# Altium schematic sheet ESC.SchDoc: FlightControlBoard-ESC
size A3; SheetNumber: 2; SheetTotal: 5
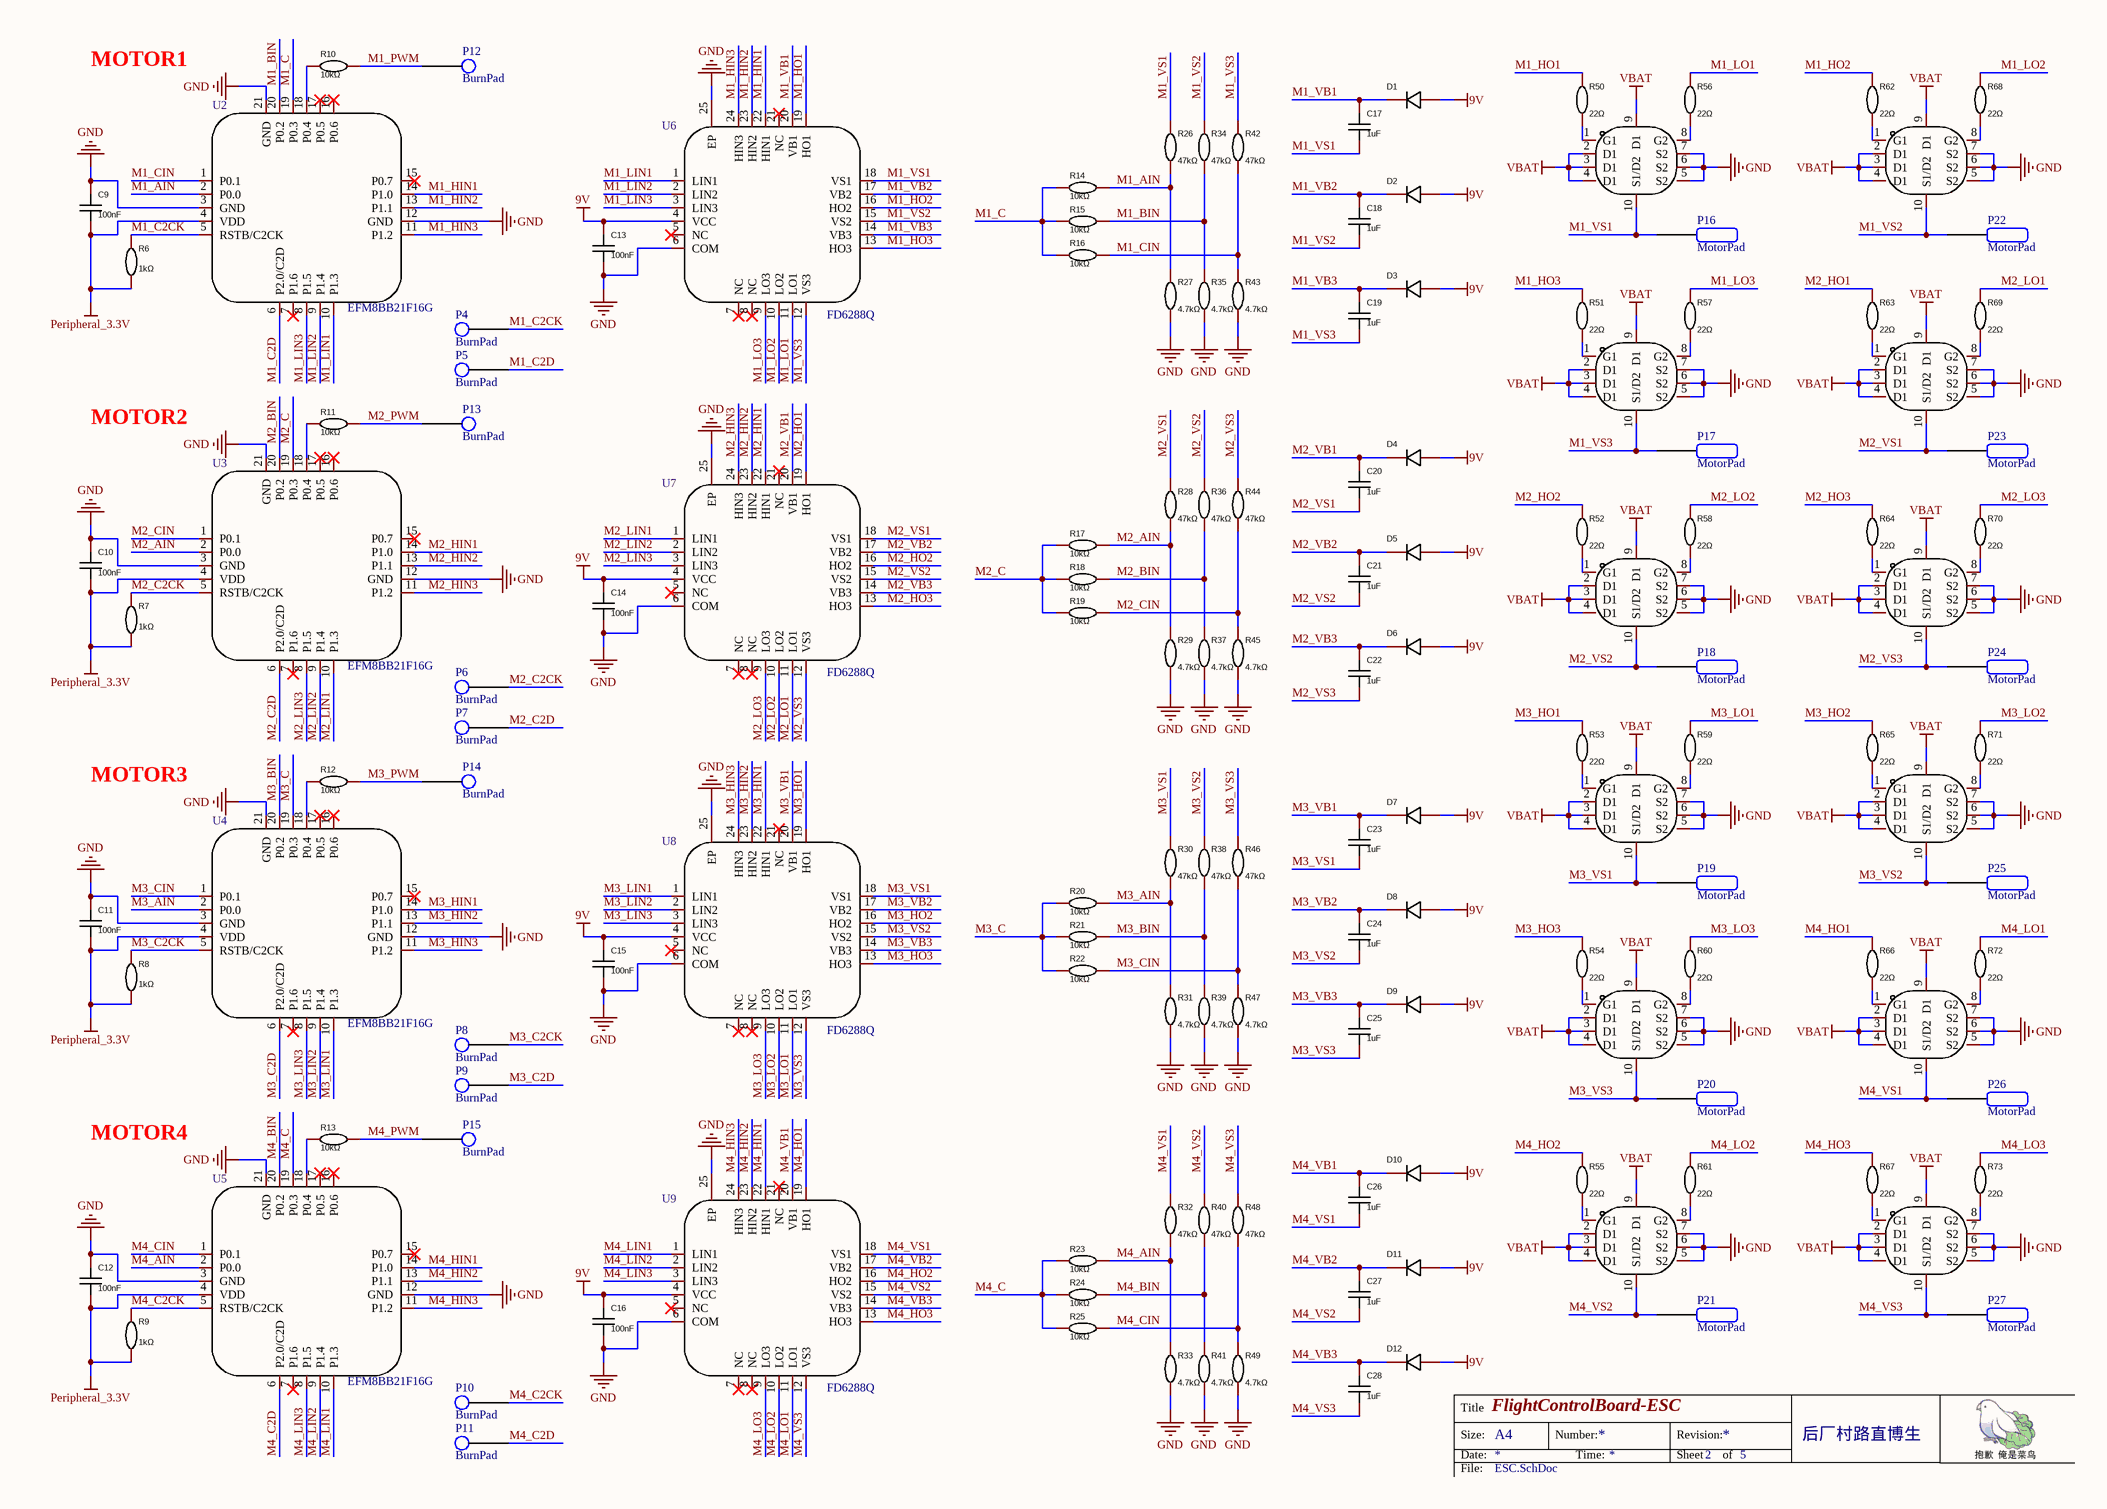
[diagram p0: ESC.SchDoc]

## Parts
C9  100nF  [C0201]
C10  100nF  [C0201]
C11  100nF  [C0201]
C12  100nF  [C0201]
C13  100nF  [C0201]
C14  100nF  [C0201]
C15  100nF  [C0201]
C16  100nF  [C0201]
C17  1uF  [C0402]
C18  1uF  [C0402]
C19  1uF  [C0402]
C20  1uF  [C0402]
C21  1uF  [C0402]
C22  1uF  [C0402]
C23  1uF  [C0402]
C24  1uF  [C0402]
C25  1uF  [C0402]
C26  1uF  [C0402]
C27  1uF  [C0402]
C28  1uF  [C0402]
D1  1N4148WT T4  [SOD-523]  (value not drawn)
D2  1N4148WT T4  [SOD-523]  (value not drawn)
D3  1N4148WT T4  [SOD-523]  (value not drawn)
D4  1N4148WT T4  [SOD-523]  (value not drawn)
D5  1N4148WT T4  [SOD-523]  (value not drawn)
D6  1N4148WT T4  [SOD-523]  (value not drawn)
D7  1N4148WT T4  [SOD-523]  (value not drawn)
D8  1N4148WT T4  [SOD-523]  (value not drawn)
D9  1N4148WT T4  [SOD-523]  (value not drawn)
D10  1N4148WT T4  [SOD-523]  (value not drawn)
D11  1N4148WT T4  [SOD-523]  (value not drawn)
D12  1N4148WT T4  [SOD-523]  (value not drawn)
P4  BurnPad  [BurnPad_0.5mm]
P5  BurnPad  [BurnPad_0.5mm]
P6  BurnPad  [BurnPad_0.5mm]
P7  BurnPad  [BurnPad_0.5mm]
P8  BurnPad  [BurnPad_0.5mm]
P9  BurnPad  [BurnPad_0.5mm]
P10  BurnPad  [BurnPad_0.5mm]
P11  BurnPad  [BurnPad_0.5mm]
P12  BurnPad  [BurnPad_0.8mm]
P13  BurnPad  [BurnPad_0.8mm]
P14  BurnPad  [BurnPad_0.8mm]
P15  BurnPad  [BurnPad_0.8mm]
P16  MotorPad  [MOTOR HALF HOLE]
P17  MotorPad  [MOTOR HALF HOLE]
P18  MotorPad  [MOTOR HALF HOLE]
P19  MotorPad  [MOTOR HALF HOLE]
P20  MotorPad  [MOTOR HALF HOLE]
P21  MotorPad  [MOTOR HALF HOLE]
P22  MotorPad  [MOTOR HALF HOLE]
P23  MotorPad  [MOTOR HALF HOLE]
P24  MotorPad  [MOTOR HALF HOLE]
P25  MotorPad  [MOTOR HALF HOLE]
P26  MotorPad  [MOTOR HALF HOLE]
P27  MotorPad  [MOTOR HALF HOLE]
Q1  AON7934  [DFN-8]  (value not drawn)
Q2  AON7934  [DFN-8]  (value not drawn)
Q3  AON7934  [DFN-8]  (value not drawn)
Q4  AON7934  [DFN-8]  (value not drawn)
Q5  AON7934  [DFN-8]  (value not drawn)
Q6  AON7934  [DFN-8]  (value not drawn)
Q7  AON7934  [DFN-8]  (value not drawn)
Q8  AON7934  [DFN-8]  (value not drawn)
Q9  AON7934  [DFN-8]  (value not drawn)
Q10  AON7934  [DFN-8]  (value not drawn)
Q11  AON7934  [DFN-8]  (value not drawn)
Q12  AON7934  [DFN-8]  (value not drawn)
R6  1kΩ  [R0201]
R7  1kΩ  [R0201]
R8  1kΩ  [R0201]
R9  1kΩ  [R0201]
R10  10kΩ  [R0201]
R11  10kΩ  [R0201]
R12  10kΩ  [R0201]
R13  10kΩ  [R0201]
R14  10kΩ  [R0201]
R15  10kΩ  [R0201]
R16  10kΩ  [R0201]
R17  10kΩ  [R0201]
R18  10kΩ  [R0201]
R19  10kΩ  [R0201]
R20  10kΩ  [R0201]
R21  10kΩ  [R0201]
R22  10kΩ  [R0201]
R23  10kΩ  [R0201]
R24  10kΩ  [R0201]
R25  10kΩ  [R0201]
R26  47kΩ  [R0201]
R27  4.7kΩ  [R0201]
R28  47kΩ  [R0201]
R29  4.7kΩ  [R0201]
R30  47kΩ  [R0201]
R31  4.7kΩ  [R0201]
R32  47kΩ  [R0201]
R33  4.7kΩ  [R0201]
R34  47kΩ  [R0201]
R35  4.7kΩ  [R0201]
R36  47kΩ  [R0201]
R37  4.7kΩ  [R0201]
R38  47kΩ  [R0201]
R39  4.7kΩ  [R0201]
R40  47kΩ  [R0201]
R41  4.7kΩ  [R0201]
R42  47kΩ  [R0201]
R43  4.7kΩ  [R0201]
R44  47kΩ  [R0201]
R45  4.7kΩ  [R0201]
R46  47kΩ  [R0201]
R47  4.7kΩ  [R0201]
R48  47kΩ  [R0201]
R49  4.7kΩ  [R0201]
R50  22Ω  [R0201]
R51  22Ω  [R0201]
R52  22Ω  [R0201]
R53  22Ω  [R0201]
R54  22Ω  [R0201]
R55  22Ω  [R0201]
R56  22Ω  [R0201]
R57  22Ω  [R0201]
R58  22Ω  [R0201]
R59  22Ω  [R0201]
R60  22Ω  [R0201]
R61  22Ω  [R0201]
R62  22Ω  [R0201]
R63  22Ω  [R0201]
R64  22Ω  [R0201]
R65  22Ω  [R0201]
R66  22Ω  [R0201]
R67  22Ω  [R0201]
R68  22Ω  [R0201]
R69  22Ω  [R0201]
R70  22Ω  [R0201]
R71  22Ω  [R0201]
R72  22Ω  [R0201]
R73  22Ω  [R0201]
U2  EFM8BB21F16G  [QFN-20_L3.0-W3.0-P0.50-BL-EP1.7_EFM8BB21F16G]
U3  EFM8BB21F16G  [QFN-20_L3.0-W3.0-P0.50-BL-EP1.7_EFM8BB21F16G]
U4  EFM8BB21F16G  [QFN-20_L3.0-W3.0-P0.50-BL-EP1.7_EFM8BB21F16G]
U5  EFM8BB21F16G  [QFN-20_L3.0-W3.0-P0.50-BL-EP1.7_EFM8BB21F16G]
U6  FD6288Q  [QFN-24_L4.0-W4.0-P0.50-BL-EP2.6]
U7  FD6288Q  [QFN-24_L4.0-W4.0-P0.50-BL-EP2.6]
U8  FD6288Q  [QFN-24_L4.0-W4.0-P0.50-BL-EP2.6]
U9  FD6288Q  [QFN-24_L4.0-W4.0-P0.50-BL-EP2.6]

## Nets
9V: C13.2 C14.2 C15.2 C16.2 D1.2(A) D2.2(A) D3.2(A) D4.2(A) D5.2(A) D6.2(A) D7.2(A) D8.2(A) D9.2(A) D10.2(A) D11.2(A) D12.2(A) U6.4(VCC) U7.4(VCC) U8.4(VCC) U9.4(VCC)
GND: C9.2 C10.2 C11.2 C12.2 C13.1 C14.1 C15.1 C16.1 Q1.5(S2) Q1.6(S2) Q1.7(S2) Q2.5(S2) Q2.6(S2) Q2.7(S2) Q3.5(S2) Q3.6(S2) Q3.7(S2) Q4.5(S2) Q4.6(S2) Q4.7(S2) Q5.5(S2) Q5.6(S2) Q5.7(S2) Q6.5(S2) Q6.6(S2) Q6.7(S2) Q7.5(S2) Q7.6(S2) Q7.7(S2) Q8.5(S2) Q8.6(S2) Q8.7(S2) Q9.5(S2) Q9.6(S2) Q9.7(S2) Q10.5(S2) Q10.6(S2) Q10.7(S2) Q11.5(S2) Q11.6(S2) Q11.7(S2) Q12.5(S2) Q12.6(S2) Q12.7(S2) R27.1 R29.1 R31.1 R33.1 R35.1 R37.1 R39.1 R41.1 R43.1 R45.1 R47.1 R49.1 U2.3(GND) U2.12(GND) U2.21(GND) U3.3(GND) U3.12(GND) U3.21(GND) U4.3(GND) U4.12(GND) U4.21(GND) U5.3(GND) U5.12(GND) U5.21(GND) U6.6(COM) U6.25(EP) U7.6(COM) U7.25(EP) U8.6(COM) U8.25(EP) U9.6(COM) U9.25(EP)
Peripheral_3.3V: C9.1 C10.1 C11.1 C12.1 R6.1 R7.1 R8.1 R9.1 U2.4(VDD) U3.4(VDD) U4.4(VDD) U5.4(VDD)
VBAT: Q1.2(D1) Q1.3(D1) Q1.4(D1) Q1.9(D1) Q2.2(D1) Q2.3(D1) Q2.4(D1) Q2.9(D1) Q3.2(D1) Q3.3(D1) Q3.4(D1) Q3.9(D1) Q4.2(D1) Q4.3(D1) Q4.4(D1) Q4.9(D1) Q5.2(D1) Q5.3(D1) Q5.4(D1) Q5.9(D1) Q6.2(D1) Q6.3(D1) Q6.4(D1) Q6.9(D1) Q7.2(D1) Q7.3(D1) Q7.4(D1) Q7.9(D1) Q8.2(D1) Q8.3(D1) Q8.4(D1) Q8.9(D1) Q9.2(D1) Q9.3(D1) Q9.4(D1) Q9.9(D1) Q10.2(D1) Q10.3(D1) Q10.4(D1) Q10.9(D1) Q11.2(D1) Q11.3(D1) Q11.4(D1) Q11.9(D1) Q12.2(D1) Q12.3(D1) Q12.4(D1) Q12.9(D1)
M1_AIN: R14.2 R26.1 R27.2 U2.2(P0.0)
M1_BIN: R15.2 R34.1 R35.2 U2.20(P0.2)
M1_C: R14.1 R15.1 R16.1 U2.19(P0.3)
M1_C2CK: P4.1 R6.2 U2.5(RSTB/C2CK)
M1_C2D: P5.1 U2.6(P2.0/C2D)
M1_CIN: R16.2 R42.1 R43.2 U2.1(P0.1)
M1_HIN1: U2.14(P1.0) U6.22(HIN1)
M1_HIN2: U2.13(P1.1) U6.23(HIN2)
M1_HIN3: U2.11(P1.2) U6.24(HIN3)
M1_HO1: R50.2 U6.19(HO1)
M1_HO2: R62.2 U6.16(HO2)
M1_HO3: R51.2 U6.13(HO3)
M1_LIN1: U2.10(P1.3) U6.1(LIN1)
M1_LIN2: U2.9(P1.4) U6.2(LIN2)
M1_LIN3: U2.8(P1.5) U6.3(LIN3)
M1_LO1: R56.2 U6.11(LO1)
M1_LO2: R68.2 U6.10(LO2)
M1_LO3: R57.2 U6.9(LO3)
M1_PWM: P12.1 R10.2
M1_VB1: C17.2 D1.1(K) U6.20(VB1)
M1_VB2: C18.2 D2.1(K) U6.17(VB2)
M1_VB3: C19.2 D3.1(K) U6.14(VB3)
M1_VS1: C17.1 P16.1 Q1.10(S1/D2) R26.2 U6.18(VS1)
M1_VS2: C18.1 P22.1 Q7.10(S1/D2) R34.2 U6.15(VS2)
M1_VS3: C19.1 P17.1 Q2.10(S1/D2) R42.2 U6.12(VS3)
M2_AIN: R17.2 R28.1 R29.2 U3.2(P0.0)
M2_BIN: R18.2 R36.1 R37.2 U3.20(P0.2)
M2_C: R17.1 R18.1 R19.1 U3.19(P0.3)
M2_C2CK: P6.1 R7.2 U3.5(RSTB/C2CK)
M2_C2D: P7.1 U3.6(P2.0/C2D)
M2_CIN: R19.2 R44.1 R45.2 U3.1(P0.1)
M2_HIN1: U3.14(P1.0) U7.22(HIN1)
M2_HIN2: U3.13(P1.1) U7.23(HIN2)
M2_HIN3: U3.11(P1.2) U7.24(HIN3)
M2_HO1: R63.2 U7.19(HO1)
M2_HO2: R52.2 U7.16(HO2)
M2_HO3: R64.2 U7.13(HO3)
M2_LIN1: U3.10(P1.3) U7.1(LIN1)
M2_LIN2: U3.9(P1.4) U7.2(LIN2)
M2_LIN3: U3.8(P1.5) U7.3(LIN3)
M2_LO1: R69.2 U7.11(LO1)
M2_LO2: R58.2 U7.10(LO2)
M2_LO3: R70.2 U7.9(LO3)
M2_PWM: P13.1 R11.2
M2_VB1: C20.2 D4.1(K) U7.20(VB1)
M2_VB2: C21.2 D5.1(K) U7.17(VB2)
M2_VB3: C22.2 D6.1(K) U7.14(VB3)
M2_VS1: C20.1 P23.1 Q8.10(S1/D2) R28.2 U7.18(VS1)
M2_VS2: C21.1 P18.1 Q3.10(S1/D2) R36.2 U7.15(VS2)
M2_VS3: C22.1 P24.1 Q9.10(S1/D2) R44.2 U7.12(VS3)
M3_AIN: R20.2 R30.1 R31.2 U4.2(P0.0)
M3_BIN: R21.2 R38.1 R39.2 U4.20(P0.2)
M3_C: R20.1 R21.1 R22.1 U4.19(P0.3)
M3_C2CK: P8.1 R8.2 U4.5(RSTB/C2CK)
M3_C2D: P9.1 U4.6(P2.0/C2D)
M3_CIN: R22.2 R46.1 R47.2 U4.1(P0.1)
M3_HIN1: U4.14(P1.0) U8.22(HIN1)
M3_HIN2: U4.13(P1.1) U8.23(HIN2)
M3_HIN3: U4.11(P1.2) U8.24(HIN3)
M3_HO1: R53.2 U8.19(HO1)
M3_HO2: R65.2 U8.16(HO2)
M3_HO3: R54.2 U8.13(HO3)
M3_LIN1: U4.10(P1.3) U8.1(LIN1)
M3_LIN2: U4.9(P1.4) U8.2(LIN2)
M3_LIN3: U4.8(P1.5) U8.3(LIN3)
M3_LO1: R59.2 U8.11(LO1)
M3_LO2: R71.2 U8.10(LO2)
M3_LO3: R60.2 U8.9(LO3)
M3_PWM: P14.1 R12.2
M3_VB1: C23.2 D7.1(K) U8.20(VB1)
M3_VB2: C24.2 D8.1(K) U8.17(VB2)
M3_VB3: C25.2 D9.1(K) U8.14(VB3)
M3_VS1: C23.1 P19.1 Q4.10(S1/D2) R30.2 U8.18(VS1)
M3_VS2: C24.1 P25.1 Q10.10(S1/D2) R38.2 U8.15(VS2)
M3_VS3: C25.1 P20.1 Q5.10(S1/D2) R46.2 U8.12(VS3)
M4_AIN: R23.2 R32.1 R33.2 U5.2(P0.0)
M4_BIN: R24.2 R40.1 R41.2 U5.20(P0.2)
M4_C: R23.1 R24.1 R25.1 U5.19(P0.3)
M4_C2CK: P10.1 R9.2 U5.5(RSTB/C2CK)
M4_C2D: P11.1 U5.6(P2.0/C2D)
M4_CIN: R25.2 R48.1 R49.2 U5.1(P0.1)
M4_HIN1: U5.14(P1.0) U9.22(HIN1)
M4_HIN2: U5.13(P1.1) U9.23(HIN2)
M4_HIN3: U5.11(P1.2) U9.24(HIN3)
M4_HO1: R66.2 U9.19(HO1)
M4_HO2: R55.2 U9.16(HO2)
M4_HO3: R67.2 U9.13(HO3)
M4_LIN1: U5.10(P1.3) U9.1(LIN1)
M4_LIN2: U5.9(P1.4) U9.2(LIN2)
M4_LIN3: U5.8(P1.5) U9.3(LIN3)
M4_LO1: R72.2 U9.11(LO1)
M4_LO2: R61.2 U9.10(LO2)
M4_LO3: R73.2 U9.9(LO3)
M4_PWM: P15.1 R13.2
M4_VB1: C26.2 D10.1(K) U9.20(VB1)
M4_VB2: C27.2 D11.1(K) U9.17(VB2)
M4_VB3: C28.2 D12.1(K) U9.14(VB3)
M4_VS1: C26.1 P26.1 Q11.10(S1/D2) R32.2 U9.18(VS1)
M4_VS2: C27.1 P21.1 Q6.10(S1/D2) R40.2 U9.15(VS2)
M4_VS3: C28.1 P27.1 Q12.10(S1/D2) R48.2 U9.12(VS3)
NetQ1_1: Q1.1(G1) R50.1
NetQ1_8: Q1.8(G2) R56.1
NetQ2_1: Q2.1(G1) R51.1
NetQ2_8: Q2.8(G2) R57.1
NetQ3_1: Q3.1(G1) R52.1
NetQ3_8: Q3.8(G2) R58.1
NetQ4_1: Q4.1(G1) R53.1
NetQ4_8: Q4.8(G2) R59.1
NetQ5_1: Q5.1(G1) R54.1
NetQ5_8: Q5.8(G2) R60.1
NetQ6_1: Q6.1(G1) R55.1
NetQ6_8: Q6.8(G2) R61.1
NetQ7_1: Q7.1(G1) R62.1
NetQ7_8: Q7.8(G2) R68.1
NetQ8_1: Q8.1(G1) R63.1
NetQ8_8: Q8.8(G2) R69.1
NetQ9_1: Q9.1(G1) R64.1
NetQ9_8: Q9.8(G2) R70.1
NetQ10_1: Q10.1(G1) R65.1
NetQ10_8: Q10.8(G2) R71.1
NetQ11_1: Q11.1(G1) R66.1
NetQ11_8: Q11.8(G2) R72.1
NetQ12_1: Q12.1(G1) R67.1
NetQ12_8: Q12.8(G2) R73.1
NetR10_1: R10.1 U2.18(P0.4)
NetR11_1: R11.1 U3.18(P0.4)
NetR12_1: R12.1 U4.18(P0.4)
NetR13_1: R13.1 U5.18(P0.4)

Not connected (* = marked no-connect by the designer): U2 7(P1.6)* 15(P0.7)* 16(P0.6)* 17(P0.5)*; U3 7(P1.6)* 15(P0.7)* 16(P0.6)* 17(P0.5)*; U4 7(P1.6)* 15(P0.7)* 16(P0.6)* 17(P0.5)*; U5 7(P1.6)* 15(P0.7)* 16(P0.6)* 17(P0.5)*; U6 5(NC)* 7(NC)* 8(NC)* 21(NC)*; U7 5(NC)* 7(NC)* 8(NC)* 21(NC)*; U8 5(NC)* 7(NC)* 8(NC)* 21(NC)*; U9 5(NC)* 7(NC)* 8(NC)* 21(NC)*

## Notes on the sheet
- MOTOR1
- MOTOR2
- MOTOR3
- MOTOR4
- Title
- Size:
- Date:
- A4
- Number:
- Time:
- Revision:
- Sheet
- of
- 后厂村路直博生
- File:

## Library data of the parts
C9-C28 = CC0603KRX7R9BB104: Add into BOM: yes; Convert to PCB: yes
  C9-C16: Name: 100nF; Value: 100nF
  C17-C28: Name: 1uF; Value: 1uF
D1-D12 = 1N4148WT T4: Manufacturer: CJ(江苏长电/长晶); Symbol: 1N4148WT_C68948; Add into BOM: yes; Diode Configuration: 独立式; Power Dissipation: 150mW; Reverse Voltage (Vr): 75V; Average Rectified Current (Io): 150mA; Forward Voltage (Vf@If): 1.25V@150mA; Reverse Leakage Current: 1uA@75V; Reverse Recovery Time (trr): 4ns; Name: 1N4148WT T4; Device: 1N4148WT T4; LCSC Part Name: 75V 150mA 4ns; Supplier Part: C68948; Manufacturer Part: 1N4148WT T4; Supplier Footprint: SOD-523; JLCPCB Part Class: Extended Part; Datasheet: https://atta.szlcsc.com/upload/public/pdf/source/20160516/1463363918425.pdf; Supplier: LCSC; Convert to PCB: yes; Operating Temperature: +150℃@(Tj)
Q1-Q12 = AON7934: Manufacturer: AOS; Add into BOM: yes; Type: 2个N沟道; Drain Source Voltage (Vdss): 30V; Continuous Drain Current (Id): 13A；15A; Power Dissipation (Pd): 2.5W; Drain Source On Resistance (RDS(on)@Vgs,Id): 10.2mΩ@13A,10V; Gate Threshold Voltage (Vgs(th)@Id): 2.2V@250uA; Total Gate Charge (Qg@Vgs): 11nC@10V; Input Capacitance (Ciss@Vds): 485pF@15V; Name: AON7934; Symbol: AON7934; Device: AON7934; LCSC Part Name: 2个N沟道 耐压:30V 电流:13A 电流:15A; Supplier Part: C485677; Manufacturer Part: AON7934; Supplier Footprint: DFN-8(3x3); JLCPCB Part Class: Extended Part; Datasheet: https://atta.szlcsc.com/upload/public/pdf/source/20200117/C485677_FDAB9B95CAD5785C045586C81566DB43.pdf; Supplier: LCSC; Convert to PCB: yes; Reverse Transfer Capacitance (Crss@Vds): -; Operating Temperature: -55℃~+150℃@(Tj)
R6-R73 = 0603WAF1002T5E: Add into BOM: yes; Convert to PCB: yes
  R6-R9: Name: 1kΩ; Value: 1kΩ
  R10-R25: Name: 10kΩ; Value: 10kΩ
  R26 R28 R30 R32 R34 R36 R38 R40 R42 R44 R46 R48: Name: 47kΩ; Value: 47kΩ
  R27 R29 R31 R33 R35 R37 R39 R41 R43 R45 R47 R49: Name: 4.7kΩ; Value: 4.7kΩ
  R50-R73: Name: 22Ω; Value: 22Ω
U2-U5 = EFM8BB21F16G: Manufacturer: SILICON LABS(芯科); Name: EFM8BB21F16G-C-QFN20R; Symbol: EFM8BB21F16G-C-QFN20; Add into BOM: yes; CPU Core: 51系列; CPU Maximum Speed: 50MHz; Operating Voltage Range: 2.2V~3.6V; Program Storage Size: 16KB; Program Memory Type: FLASH; RAM Size: 2.25KB; GPIO Ports Number: 16; ADC (Bit): 12bit; Peripheral/Function: 看门狗；PWM; Internal Oscillator: 有; Device: EFM8BB21F16G-C-QFN20R; LCSC Part Name: 51系列 50MHz; Supplier Part: C80713; Manufacturer Part: EFM8BB21F16G-C-QFN20R; Supplier Footprint: QFN-20-EP(3x3); JLCPCB Part Class: Extended Part; Datasheet: https://atta.szlcsc.com/upload/public/pdf/source/20160823/1471947533781.pdf; Supplier: LCSC; Convert to PCB: yes; EEPROM: -; DAC (Bit): -; PWM (Bit): -; Universal Serial Bus: -; Internal Comparator: -; communication protocol: -; Watchdog: -; Real-Time Clock: -; Infrared Data Association: -; Low-Voltage Detect: -; CCP Capture/Compare: -; Secure Digital Input and Output: -; Direct Memory Access: -; Operating Temperature Range: -40℃~+85℃
U6-U9 = FD6288Q: Manufacturer: Fortior Tech(峰岹); Symbol: FD6288Q_C328453; Add into BOM: yes; Name: FD6288Q; Device: FD6288Q; LCSC Part Name: FD6288Q; Supplier Part: C328453; Manufacturer Part: FD6288Q; Supplier Footprint: QFN-24-EP(4x4); JLCPCB Part Class: Extended Part; Datasheet: https://atta.szlcsc.com/upload/public/pdf/source/20181108/C328453_785547738DB9FC0123219FC22539EFAD.pdf; Supplier: LCSC; Convert to PCB: yes